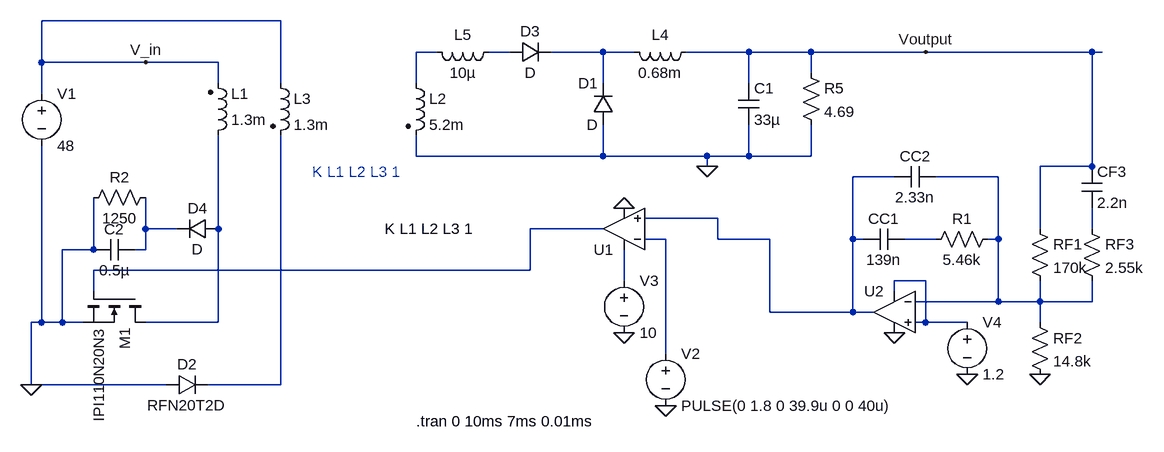
[diagram p0: schematic compansator_forward_2.asc]
compansator_forward_2.asc, the LTspice schematic file:
Version 4
SHEET 1 1028 740
WIRE -304 32 -672 32
WIRE -64 80 -96 80
WIRE 48 80 16 80
WIRE 192 80 112 80
WIRE 240 80 192 80
WIRE 416 80 320 80
WIRE 512 80 416 80
WIRE 688 80 512 80
WIRE 944 80 688 80
WIRE 960 80 944 80
WIRE -672 96 -672 32
WIRE -512 96 -672 96
WIRE -400 96 -512 96
WIRE 512 112 512 80
WIRE -400 128 -400 96
WIRE -304 128 -304 32
WIRE -96 128 -96 80
WIRE 192 128 192 80
WIRE 416 128 416 80
WIRE -672 144 -672 96
WIRE -96 240 -96 208
WIRE 192 240 192 192
WIRE 192 240 -96 240
WIRE 352 240 192 240
WIRE 416 240 416 192
WIRE 416 240 352 240
WIRE 512 240 512 192
WIRE 512 240 416 240
WIRE 352 256 352 240
WIRE 944 256 944 80
WIRE 944 256 864 256
WIRE 640 272 576 272
WIRE 800 272 704 272
WIRE 368 336 256 336
WIRE -512 352 -512 304
WIRE -464 352 -512 352
WIRE -400 352 -400 208
WIRE 192 352 80 352
WIRE 864 352 864 256
WIRE 944 352 944 320
WIRE 288 368 256 368
WIRE 368 368 368 336
WIRE 448 368 368 368
WIRE 576 368 576 272
WIRE 592 368 576 368
WIRE 704 368 656 368
WIRE 800 368 800 272
WIRE 800 368 784 368
WIRE -592 384 -592 304
WIRE -592 384 -640 384
WIRE -512 384 -512 352
WIRE -512 384 -528 384
WIRE 80 416 80 352
WIRE 80 416 -592 416
WIRE 224 432 224 384
WIRE 688 432 640 432
WIRE -592 448 -592 416
WIRE 640 448 640 432
WIRE 800 464 800 368
WIRE 800 464 672 464
WIRE 864 464 864 432
WIRE 864 464 800 464
WIRE 944 464 944 432
WIRE 944 464 864 464
WIRE 448 480 448 368
WIRE 576 480 576 368
WIRE 576 480 448 480
WIRE 608 480 576 480
WIRE -672 496 -672 224
WIRE -672 496 -688 496
WIRE -640 496 -640 384
WIRE -640 496 -672 496
WIRE -608 496 -640 496
WIRE -400 496 -400 352
WIRE -400 496 -512 496
WIRE 688 496 688 432
WIRE 688 496 672 496
WIRE 752 496 688 496
WIRE 864 496 864 464
WIRE 288 544 288 368
WIRE -688 592 -688 496
WIRE -480 592 -688 592
WIRE -304 592 -304 208
WIRE -304 592 -416 592
FLAG 224 320 0
FLAG 288 624 0
FLAG 224 512 0
FLAG 640 512 0
FLAG 752 576 0
FLAG 864 576 0
FLAG 688 80 Voutput
FLAG 352 256 0
FLAG -512 96 V_in
FLAG -688 592 0
SYMBOL voltage -672 128 R0
WINDOW 123 0 0 Left 2
WINDOW 39 0 0 Left 2
SYMATTR InstName V1
SYMATTR Value 48
SYMBOL ind2 -416 224 M180
WINDOW 0 36 80 Left 2
WINDOW 3 36 40 Left 2
SYMATTR InstName L1
SYMATTR Value 1.3m
SYMATTR SpiceLine Rser=1m
SYMATTR Type ind
SYMBOL cap 400 128 R0
SYMATTR InstName C1
SYMATTR Value 33µ
SYMATTR SpiceLine Rser=3m
SYMBOL Opamps\\UniversalOpamp2 224 352 R180
SYMATTR InstName U1
SYMBOL voltage 288 528 R0
WINDOW 123 0 0 Left 2
WINDOW 39 0 0 Left 2
SYMATTR InstName V2
SYMATTR Value PULSE(0 1.8 0 39.9u 0 0 40u)
SYMBOL voltage 224 416 R0
WINDOW 123 0 0 Left 2
WINDOW 39 0 0 Left 2
SYMATTR InstName V3
SYMATTR Value 10
SYMBOL res 800 352 R90
WINDOW 0 0 56 VBottom 2
WINDOW 3 32 56 VTop 2
SYMATTR InstName R1
SYMATTR Value 5.46k
SYMBOL cap 656 352 R90
WINDOW 0 0 32 VBottom 2
WINDOW 3 32 32 VTop 2
SYMATTR InstName CC1
SYMATTR Value 139n
SYMBOL cap 704 256 R90
WINDOW 0 0 32 VBottom 2
WINDOW 3 32 32 VTop 2
SYMATTR InstName CC2
SYMATTR Value 2.33n
SYMBOL Opamps\\UniversalOpamp2 640 480 M0
SYMATTR InstName U2
SYMBOL voltage 752 480 R0
WINDOW 123 0 0 Left 2
WINDOW 39 0 0 Left 2
SYMATTR InstName V4
SYMATTR Value 1.2
SYMBOL res 848 336 R0
SYMATTR InstName RF1
SYMATTR Value 170k
SYMBOL res 928 336 R0
SYMATTR InstName RF3
SYMATTR Value 2.55k
SYMBOL cap 928 256 R0
SYMATTR InstName CF3
SYMATTR Value 2.2n
SYMBOL res 848 480 R0
SYMATTR InstName RF2
SYMATTR Value 14.8k
SYMBOL res 496 96 R0
SYMATTR InstName R5
SYMATTR Value 4.69
SYMBOL ind2 -112 112 R0
SYMATTR InstName L2
SYMATTR Value 5.2m
SYMATTR Type ind
SYMATTR SpiceLine Rser=1m
SYMBOL ind2 -320 112 R0
SYMATTR InstName L3
SYMATTR Value 1.3m
SYMATTR Type ind
SYMATTR SpiceLine Rser=1m
SYMBOL ind 336 64 R90
WINDOW 0 5 56 VBottom 2
WINDOW 3 32 56 VTop 2
SYMATTR InstName L4
SYMATTR Value 0.68m
SYMATTR SpiceLine Rser=60m
SYMBOL nmos -512 448 R90
SYMATTR InstName M1
SYMATTR Value IPI110N20N3
SYMBOL diode 208 192 R180
WINDOW 0 24 64 Left 2
WINDOW 3 24 0 Left 2
SYMATTR InstName D1
SYMBOL diode 48 96 R270
WINDOW 0 32 32 VTop 2
WINDOW 3 0 32 VBottom 2
SYMATTR InstName D3
SYMBOL diode -480 608 R270
WINDOW 0 32 32 VTop 2
WINDOW 3 0 32 VBottom 2
SYMATTR InstName D2
SYMATTR Value RFN20T2D
SYMBOL ind 32 64 R90
WINDOW 0 5 56 VBottom 2
WINDOW 3 32 56 VTop 2
SYMATTR InstName L5
SYMATTR Value 10µ
SYMBOL diode -400 336 R90
WINDOW 0 0 32 VBottom 2
WINDOW 3 32 32 VTop 2
SYMATTR InstName D4
SYMBOL res -496 288 R90
WINDOW 0 0 56 VBottom 2
WINDOW 3 32 56 VTop 2
SYMATTR InstName R2
SYMATTR Value 1250
SYMBOL cap -528 368 R90
WINDOW 0 0 32 VBottom 2
WINDOW 3 32 32 VTop 2
SYMATTR InstName C2
SYMATTR Value 0.5µ
TEXT -96 648 Left 2 !.tran 0 10ms 7ms 0.01ms
TEXT -256 264 Left 2 ;K L1 L2 L3 1
TEXT -144 352 Left 2 !K L1 L2 L3 1

The netlist it stands for:
* compansator_forward_2.asc
V1 V_in 0 48
L1 N007 V_in 1.3m Rser=1m
C1 Voutput 0 33µ Rser=3m
XU1 N004 N010 N012 0 N008 level.2 Avol=1Meg GBW=10Meg Slew=10Meg ilimit=25m rail=0 Vos=0 phimargin=45 en=0 enk=0 in=0 ink=0 Rin=500Meg  ; pins IN+ IN- V+ V- OUT
V2 N010 0 PULSE(0 1.8 0 39.9u 0 0 40u)
V3 N012 0 10
R1 N005 N011 5.46k
CC1 N011 N004 139n
CC2 N005 N004 2.33n
XU2 N013 N005 N013 0 N004 level.2 Avol=1Meg GBW=10Meg Slew=10Meg ilimit=25m rail=0 Vos=0 phimargin=45 en=0 enk=0 in=0 ink=0 Rin=500Meg  ; pins IN+ IN- V+ V- OUT
V4 N013 0 1.2
RF1 Voutput N005 170k
RF3 N009 N005 2.55k
CF3 Voutput N009 2.2n
RF2 N005 0 14.8k
R5 Voutput 0 4.69
L2 N001 0 5.2m Rser=1m
L3 V_in N014 1.3m Rser=1m
L4 Voutput N003 0.68m Rser=60m
M1 N007 N008 0 0 IPI110N20N3
D1 0 N003 D
D3 N002 N003 D
D2 0 N014 RFN20T2D
L5 N002 N001 10µ
D4 N007 N006 D
R2 N006 0 1250
C2 N006 0 0.5µ
.model D D
.lib standard.dio
.model NMOS NMOS
.model PMOS PMOS
.lib standard.mos
.tran 0 10ms 7ms 0.01ms
* K L1 L2 L3 1
K L1 L2 L3 1
.lib UniversalOpamps2.sub
.backanno
.end